# Altium schematic sheet Bank0&1.SchDoc
size A4
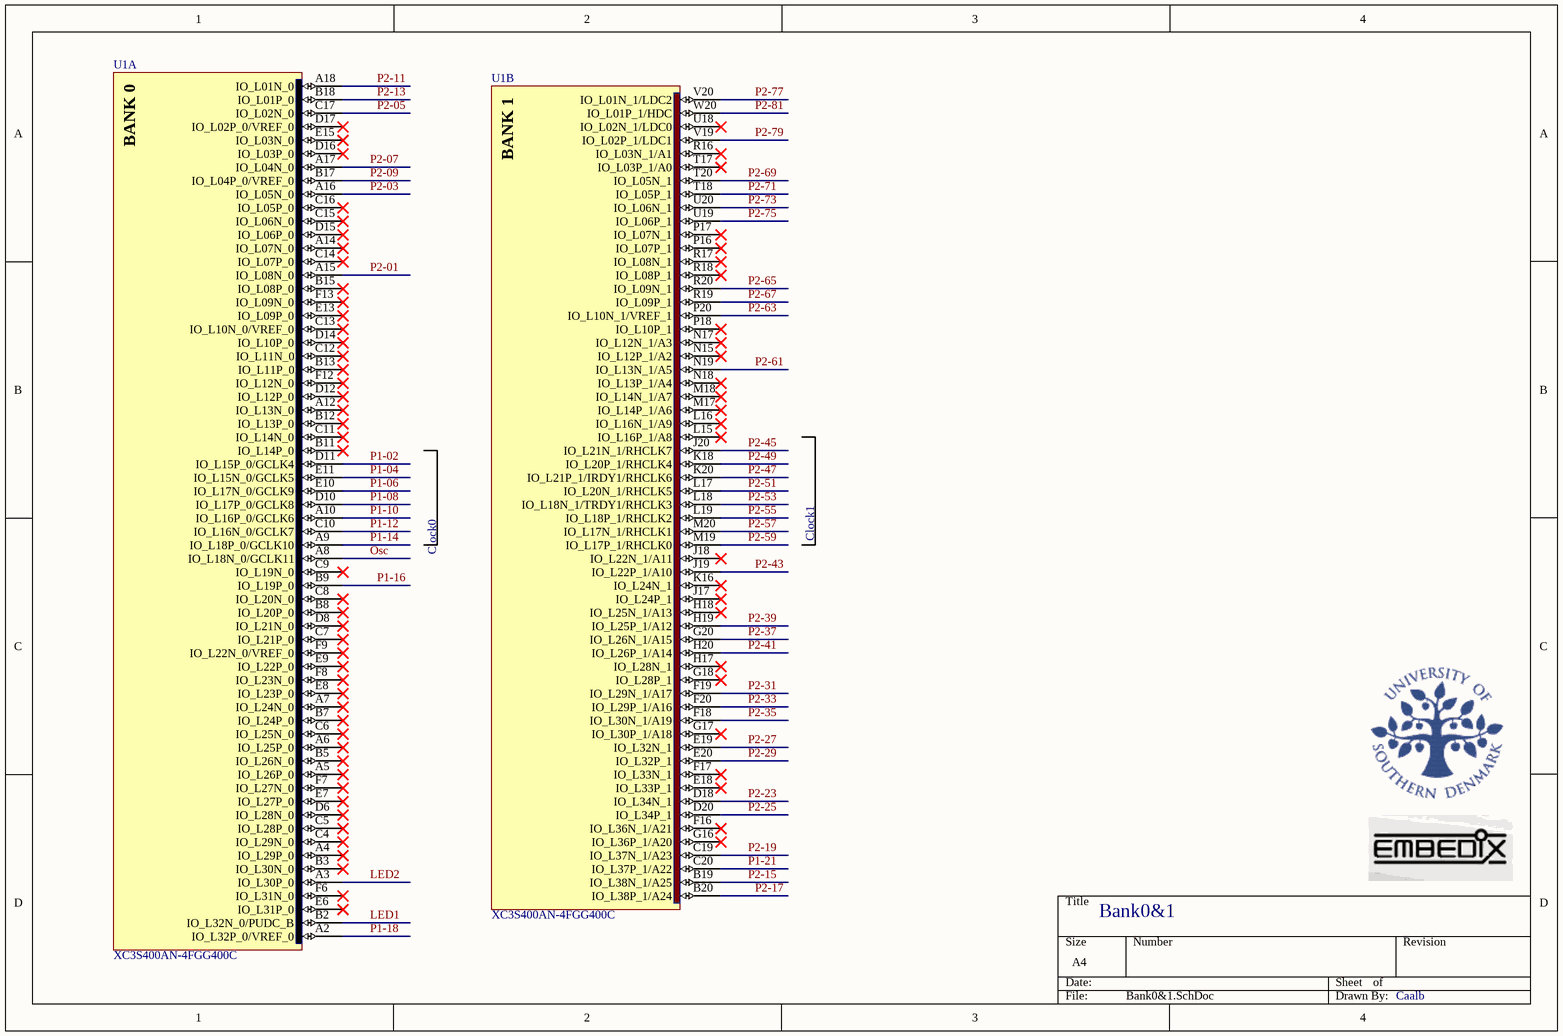
[diagram p0: Bank0&1.SchDoc]

## Parts
U1  XC3S400AN-4FGG400C  [FGG400]  (parts A,B of 8)

## Nets
LED1: U1.B2(IO_L32N_0/PUDC_B)
LED2: U1.A3(IO_L30P_0)
Osc: U1.A8(IO_L18N_0/GCLK11)
P1-02: U1.D11(IO_L15P_0/GCLK4)
P1-04: U1.E11(IO_L15N_0/GCLK5)
P1-06: U1.E10(IO_L17N_0/GCLK9)
P1-08: U1.D10(IO_L17P_0/GCLK8)
P1-10: U1.A10(IO_L16P_0/GCLK6)
P1-12: U1.C10(IO_L16N_0/GCLK7)
P1-14: U1.A9(IO_L18P_0/GCLK10)
P1-16: U1.B9(IO_L19P_0)
P1-18: U1.A2(IO_L32P_0/VREF_0)
P1-21: U1.C20(IO_L37P_1/A22)
P2-01: U1.A15(IO_L08N_0)
P2-03: U1.A16(IO_L05N_0)
P2-05: U1.C17(IO_L02N_0)
P2-07: U1.A17(IO_L04N_0)
P2-09: U1.B17(IO_L04P_0/VREF_0)
P2-11: U1.A18(IO_L01N_0)
P2-13: U1.B18(IO_L01P_0)
P2-15: U1.B19(IO_L38N_1/A25)
P2-17: U1.B20(IO_L38P_1/A24)
P2-19: U1.C19(IO_L37N_1/A23)
P2-23: U1.D18(IO_L34N_1)
P2-25: U1.D20(IO_L34P_1)
P2-27: U1.E19(IO_L32N_1)
P2-29: U1.E20(IO_L32P_1)
P2-31: U1.F19(IO_L29N_1/A17)
P2-33: U1.F20(IO_L29P_1/A16)
P2-35: U1.F18(IO_L30N_1/A19)
P2-37: U1.G20(IO_L26N_1/A15)
P2-39: U1.H19(IO_L25P_1/A12)
P2-41: U1.H20(IO_L26P_1/A14)
P2-43: U1.J19(IO_L22P_1/A10)
P2-45: U1.J20(IO_L21N_1/RHCLK7)
P2-47: U1.K20(IO_L21P_1/IRDY1/RHCLK6)
P2-49: U1.K18(IO_L20P_1/RHCLK4)
P2-51: U1.L17(IO_L20N_1/RHCLK5)
P2-53: U1.L18(IO_L18N_1/TRDY1/RHCLK3)
P2-55: U1.L19(IO_L18P_1/RHCLK2)
P2-57: U1.M20(IO_L17N_1/RHCLK1)
P2-59: U1.M19(IO_L17P_1/RHCLK0)
P2-61: U1.N19(IO_L13N_1/A5)
P2-63: U1.P20(IO_L10N_1/VREF_1)
P2-65: U1.R20(IO_L09N_1)
P2-67: U1.R19(IO_L09P_1)
P2-69: U1.T20(IO_L05N_1)
P2-71: U1.T18(IO_L05P_1)
P2-73: U1.U20(IO_L06N_1)
P2-75: U1.U19(IO_L06P_1)
P2-77: U1.V20(IO_L01N_1/LDC2)
P2-79: U1.V19(IO_L02P_1/LDC1)
P2-81: U1.W20(IO_L01P_1/HDC)

Not connected (* = marked no-connect by the designer): U1 A4(IO_L29P_0)* A5(IO_L26P_0)* A6(IO_L25P_0)* A7(IO_L24N_0)* A12(IO_L13N_0)* A14(IO_L07N_0)* B3(IO_L30N_0)* B5(IO_L26N_0)* B7(IO_L24P_0)* B8(IO_L20P_0)* B11(IO_L14P_0)* B12(IO_L13P_0)* B13(IO_L11P_0)* B15(IO_L08P_0)* C4(IO_L29N_0)* C5(IO_L28P_0)* C6(IO_L25N_0)* C7(IO_L21P_0)* C8(IO_L20N_0)* C9(IO_L19N_0)* C11(IO_L14N_0)* C12(IO_L11N_0)* C13(IO_L10N_0/VREF_0)* C14(IO_L07P_0)* C15(IO_L06N_0)* C16(IO_L05P_0)* D6(IO_L28N_0)* D8(IO_L21N_0)* D12(IO_L12P_0)* D14(IO_L10P_0)* D15(IO_L06P_0)* D16(IO_L03P_0)* D17(IO_L02P_0/VREF_0)* E6(IO_L31P_0)* E7(IO_L27P_0)* E8(IO_L23P_0)* E9(IO_L22P_0)* E13(IO_L09P_0)* E15(IO_L03N_0)* E18(IO_L33P_1)* F6(IO_L31N_0)* F7(IO_L27N_0)* F8(IO_L23N_0)* F9(IO_L22N_0/VREF_0)* F12(IO_L12N_0)* F13(IO_L09N_0)* F16(IO_L36N_1/A21)* F17(IO_L33N_1)* G16(IO_L36P_1/A20)* G17(IO_L30P_1/A18)* G18(IO_L28P_1)* H17(IO_L28N_1)* H18(IO_L25N_1/A13)* J17(IO_L24P_1)* J18(IO_L22N_1/A11)* K16(IO_L24N_1)* L15(IO_L16P_1/A8)* L16(IO_L16N_1/A9)* M17(IO_L14P_1/A6)* M18(IO_L14N_1/A7)* N15(IO_L12P_1/A2)* N17(IO_L12N_1/A3)* N18(IO_L13P_1/A4)* P16(IO_L07P_1)* P17(IO_L07N_1)* P18(IO_L10P_1)* R16(IO_L03N_1/A1)* R17(IO_L08N_1)* R18(IO_L08P_1)* T17(IO_L03P_1/A0)* U18(IO_L02N_1/LDC0)*

## Notes on the sheet
- Clock0
- Clock1
- Bank0&1
- Caalb
- (in symbol XC3S400AN-4FGG400C, part A) BANK 0
- (in symbol XC3S400AN-4FGG400C, part B) BANK 1

## Library data of the parts
U1 = XC3S400AN-4FGG400C: Spartan-3AN Non-Volatile FPGA, 311 User I/Os, 400-Pin FBGA, Standard Performance, Commercial Grade, Pb-Free; Published: 20-Jul-2007; DatasheetVersion: 26-Feb-2007; PackageVersion: ver1.0, Mar-2005; PackageReference: FGG400; Publisher: Altium Limited; PackageDescription: 400-Ball Fine Pitch Ball Grid Array 1.00 mm Pitch (FGG400) - Pb-Free; Code_JEDEC: MS-034-AAH-1; Code_IPC: BGA100P20X20-400; ComponentLink1Description: Manufacturer Link; ComponentLink1URL: http://www.xilinx.com/products/silicon_solutions/fpgas/spartan_series/spartan3an_fpgas/index.htm; ComponentLink2Description: Datasheet; ComponentLink2URL: http://direct.xilinx.com/bvdocs/publications/ds557.pdf